# EAGLE schematic coil-control-module-v3 (EAGLE 7.1.0)
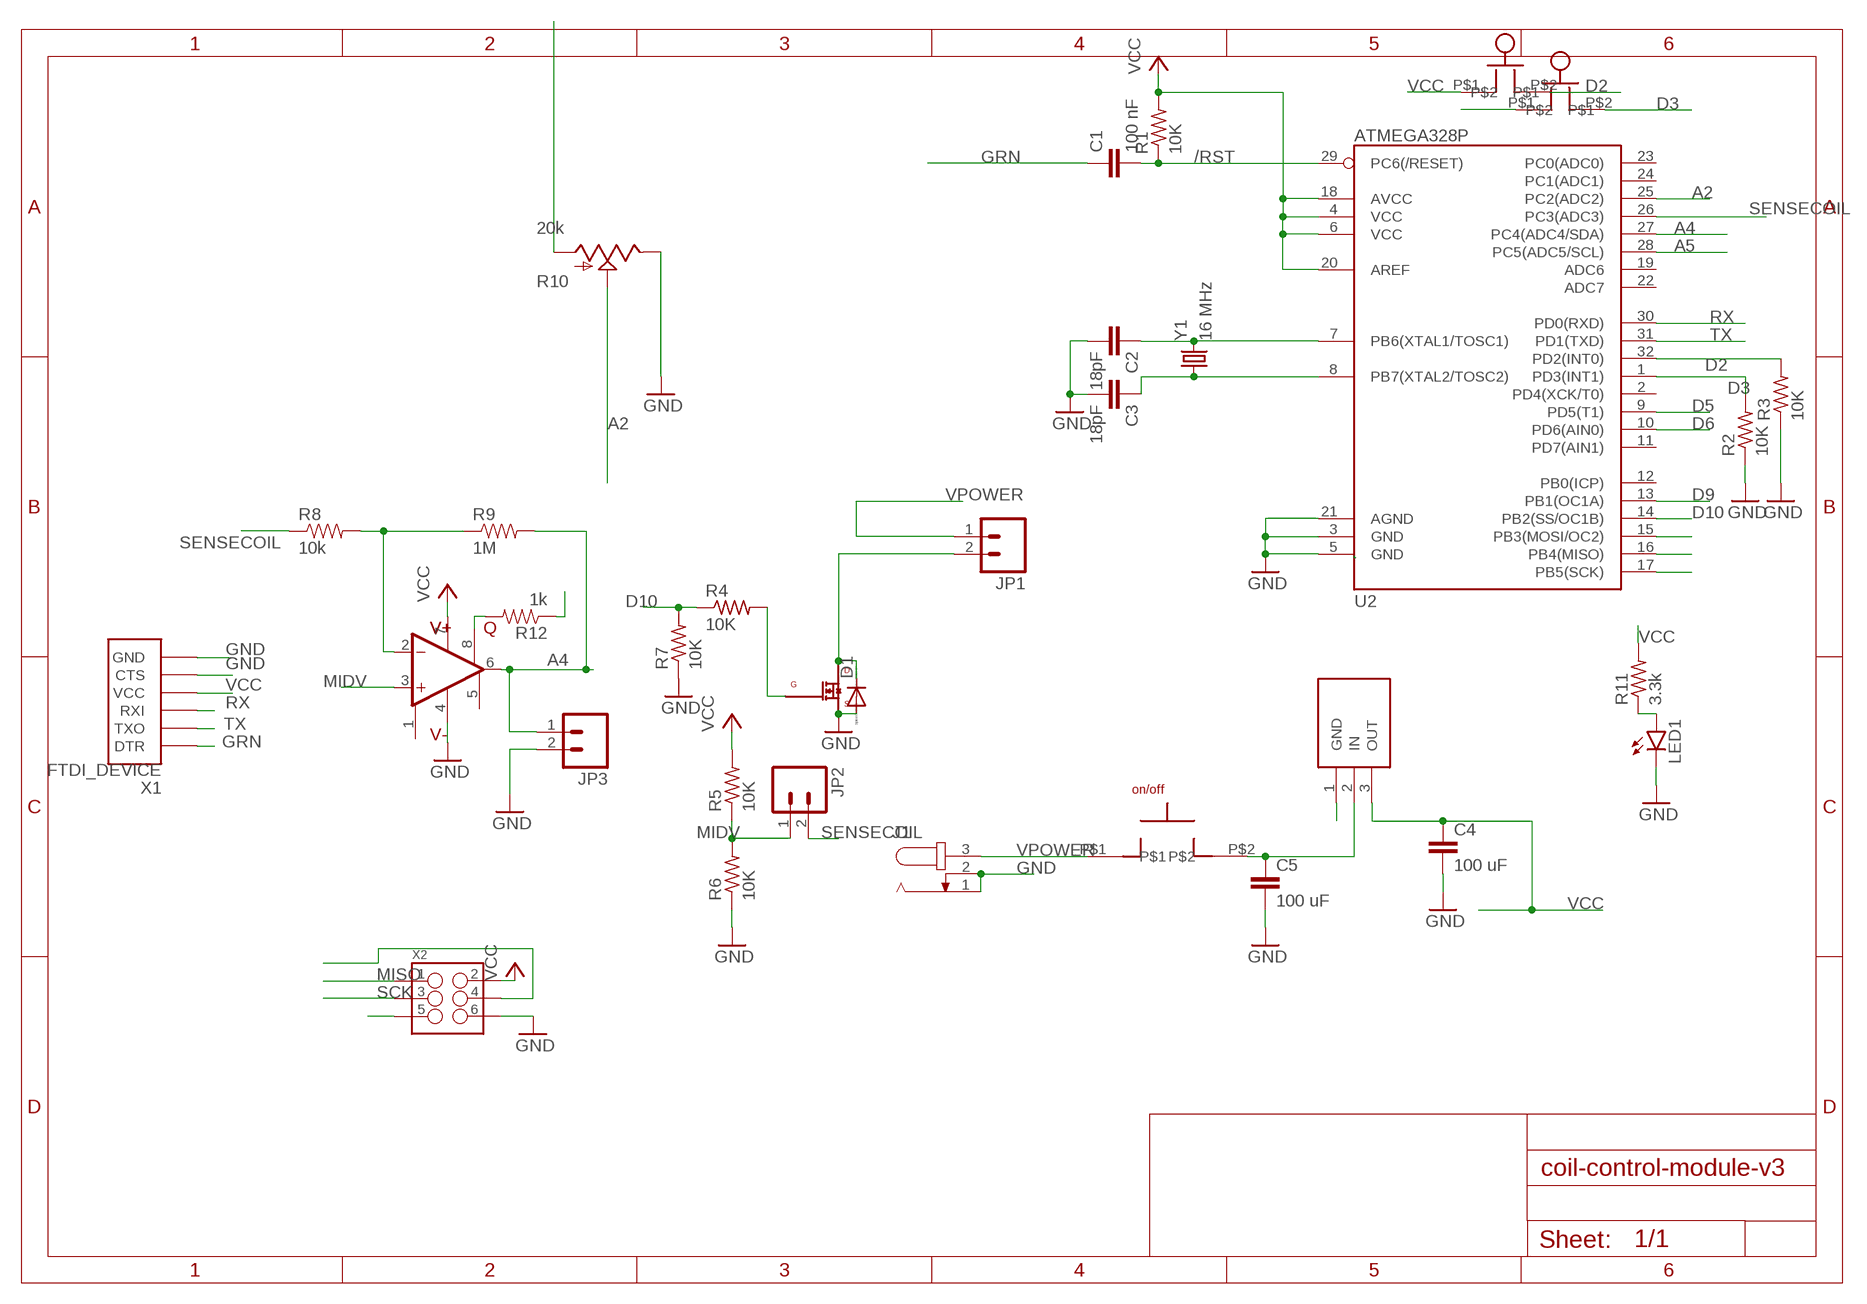
[diagram p0: schematic, sheet 1]

## Parts
C1  100 nF  CAP0603-CAP  [0603-CAP]
C2  18pF  C-EUC0603  [C0603]
C3  18pF  C-EUC0603  [C0603]
C4  100 uF  CAP1206  [1206]
C5  100 uF  CAP1206  [1206]
D1  DIODE-DO-214AC  [DO-214AC]
J1  JACK-PLUG1  [SPC4078]
JP1  M02PTH  [1X02]
JP2  M02PTH  [1X02]
JP3  M02PTH  [1X02]
LED1  LED-3MM-NO_SILK  [LED3MM-NS]
R1  10K  R-US_R0603  [R0603]
R2  10K  R-US_R0603  [R0603]
R3  10K  R-US_R0603  [R0603]
R4  10K  R-US_R0603  [R0603]
R5  10K  R-US_R0603  [R0603]
R6  10K  R-US_R0603  [R0603]
R7  10K  R-US_R0603  [R0603]
R8  10k  RESISTOR0603  [0603-RES]
R9  1M  RESISTOR0805-RES  [0805]
R10  20k  POTALPS-KIT  [ALPS_POT_KIT]
R11  3.3k  R-US_R0603  [R0603]
R12  1k  RESISTOR0603  [0603-RES]
SW1  CW182-ND  [CW182-ND]
SW2  BUTTON  [BUTTON]
SW3  BUTTON  [BUTTON]
U2  ATMEGA328P  ATMEGA328_SMT  [TQFP32-08]
U4  MCP1700  [TO92-3]
U$5  LM4250  [DIP08]
U$6  IRLML0060  [SOT-23]
X1  FTDI_DEVICE  [FTDI_DEVICE_SIDE]
X2  M03X2NO_SILK  [2X3-NS]
Y1  16 MHz  CRYSTAL5X3  [CRYSTAL-SMD-5X3]

## Nets
/RST: C1.2 R1.1 U2.29(PC6(/RESET)) X2.5
A2: R10.P$2(S) U2.25(PC2(ADC2))
A4: JP3.1 R9.2 U2.27(PC4(ADC4/SDA)) U$5.6(OUT)
A5: U2.28(PC5(ADC5/SCL))
D2: R3.2 SW2.P$2 U2.32(PD2(INT0))
D3: R2.2 SW3.P$2 U2.1(PD3(INT1))
D5: U2.9(PD5(T1))
D6: U2.10(PD6(AIN0))
D9: U2.13(PB1(OC1A))
D10: R4.1 R7.2 U2.14(PB2(SS/OC1B))
GND: C2.2 C3.2 C4.2 C5.2 D1.A J1.1 J1.2 JP3.2 LED1.K(C) R2.1 R3.1 R6.1 R7.1 R10.P$1(E) U2.3(GND) U2.5(GND) U2.21(AGND) U4.1(GND) U$5.4(V-) U$6.2(SOURCE) X1.P$5(CTS) X1.P$6(GND) X2.6
GRN: C1.1 X1.P$1(DTR)
MIDV: JP2.1 R5.1 R6.2 R12.1 U$5.3(+IN)
MISO: U2.16(PB4(MISO)) X2.1
MOSI: U2.15(PB3(MOSI/OC2)) X2.4
N$3: D1.C JP1.2 U$6.3(DRAIN)
N$4: C2.1 U2.7(PB6(XTAL1/TOSC1)) Y1.3
N$10: LED1.A R11.1
N$11: C3.1 U2.8(PB7(XTAL2/TOSC2)) Y1.1
N$14: R8.2 R9.1 U$5.2(-IN)
N$16: R12.2 U$5.8(QUIES)
N$27: R4.2 U$6.1(GATE)
RX: U2.30(PD0(RXD)) X1.P$3(RXI)
SCK: U2.17(PB5(SCK)) X2.3
SENSECOIL: JP2.2 R8.1 U2.26(PC3(ADC3))
TX: U2.31(PD1(TXD)) X1.P$2(TXO)
VCC: C4.1 R1.2 R5.2 R10.P$3(A) R11.2 SW2.P$1 SW3.P$1 U2.4(VCC) U2.6(VCC) U2.18(AVCC) U2.20(AREF) U4.3(OUT) U$5.7(V+) X1.P$4(VCC) X2.2
VIN: C5.1 SW1.P$2 U4.2(IN)
VPOWER: J1.3 JP1.1 SW1.P$1
Unconnected: U2.2(PD4(XCK/T0)) U2.11(PD7(AIN1)) U2.12(PB0(ICP)) U2.19(ADC6) U2.22(ADC7) U2.23(PC0(ADC0)) U2.24(PC1(ADC1)) U$5.1(NULL1) U$5.5(NULL2)

## Library data of the parts
C1 = SparkFun-Passives:CAP: Capacitor Standard 0603 ceramic capacitor, and 0.1" leaded capacitor.
C2 C3 = resistor:C-EU: CAPACITOR, European symbol
C4 C5 = SparkFun-Capacitors:CAP: Capacitor Standard 0603 ceramic capacitor, and 0.1" leaded capacitor.
D1 = diode:DIODE-: DIODE
J1 = con-jack:JACK-PLUG: DC POWER JACK Power Jack, DC, Right Angle, Through Hole, Rated 5A at 16VDC, PC Terminals Distributor: Farnell (www.Farnell.de) Drawing: 84N1161.pdf / 84N1162.pdf Manufacturer: SPC Technology (www.spctechnology.com) Type: SPC4077 / SPC 4078; OC_FARNELL: unknown; OC_NEWARK: unknown
JP1-JP3 = SparkFun-Connectors:M02: Standard 2-pin 0.1" header. Use with - straight break away headers ( PRT-00116) - right angle break away headers (PRT-00553) - swiss pins (PRT-00743) - machine pins (PRT-00117) - female headers (PRT-00115) Molex polarized connector foot print use with: PRT-08233 with associated crimp pins and housings. 2.54_SCREWTERM for use with PRT-10571. 3.5mm Screw Terminal footprints for PRT-08084 5mm Screw Terminal footprints for use with PRT-08432
LED1 = SparkFun-LED:LED: LEDs Standard schematic elements and footprints for 5mm, 3mm, 1206, and 0603 sized LEDs. 5mm - Spark Fun Electronics SKU : COM-00529 (and others)
R1-R7 R11 = resistor:R-US_: RESISTOR, American symbol
R8 R12 = SparkFun-Resistors:RESISTOR: Resistor Basic schematic elements and footprints for 0603, 1206, and PTH resistors.
R9 = SparkFun-Passives:RESISTOR: Resistor Basic schematic elements and footprints for 0603, 1206, and PTH resistors.
R10 = SparkFun-Electromechanical:POT
SW1 = spietz-library:CW182-ND
SW2 SW3 = spietz-library:BUTTON
U2 = SparkFun-DigitalIC:ATMEGA328_SMT: 32-Pin Atmega328 part Commonly used on Arduino compatible boards Available in QFP and QFN packages TQFP is IC-09069 QFN is non-stock; PROD_ID: IC-09069
U4 = spietz-library:MCP1700
U$5 = spietz-library:LM4250
U$6 = spietz-library:IRLML0060
X1 = SparkFun-Connectors:FTDI_DEVICE: Connector which mates to FTDI basic or FTDI cable.
X2 = SparkFun-Connectors:M03X2: 2x3 .1" header. Shrouded, with keying- CONN-10681 SMT- CONN-11415 Pogo pins- HW-11044
Y1 = SparkFun-FreqCtrl:CRYSTAL: Various standard crystals. Proven footprints. Spark Fun Electronics SKU : COM-00534

## Net classes
0 default: width 0.203 mm
1 vcc: width 0.254 mm